# Altium schematic sheet SCH_AP-DIsplay-2.1_Altium.schdoc
size 302 x 211 mm
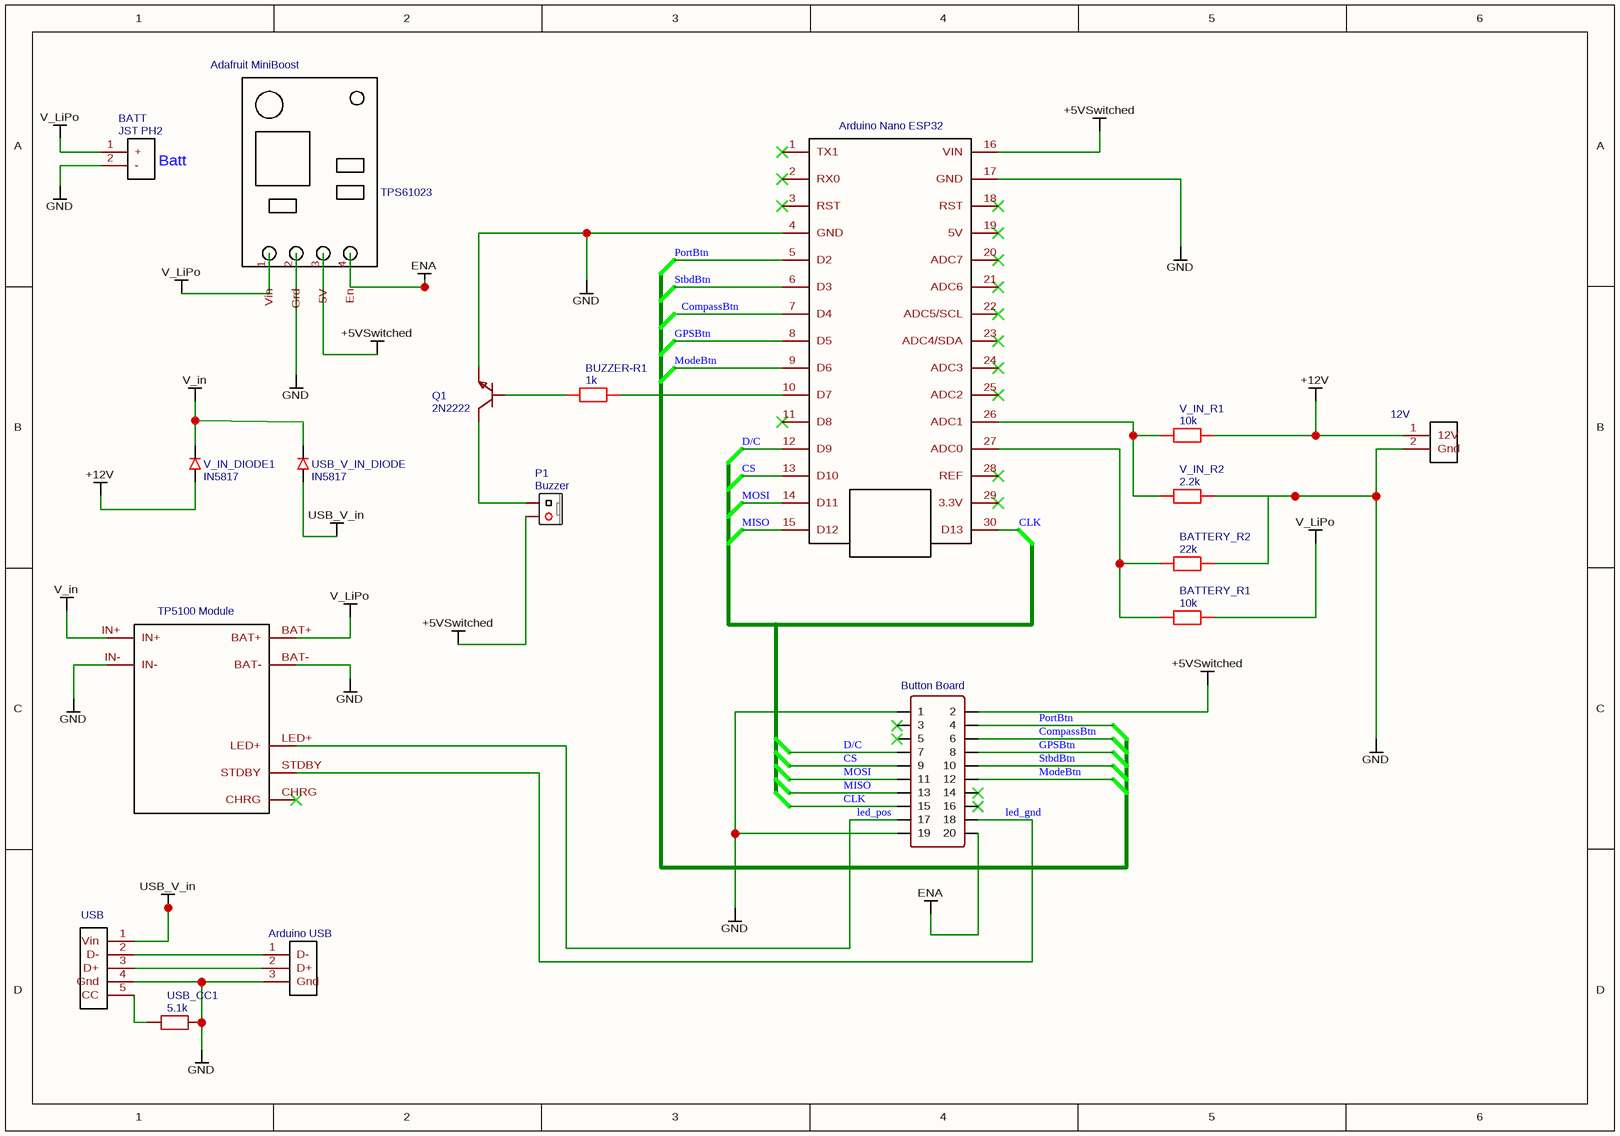
[diagram p0: SCH_AP-DIsplay-2.1_Altium.schdoc]

## Parts
1X2_JST_XH  12V  [1X2 JST XH]
BATT  JST PH2  [JST-PH-JST-PH2]
BATTERY_R1  10k  [R_AXIAL-0.5]
BATTERY_R2  22k  [R_AXIAL-0.5]
BUTTON_LED1  Button Board  [HDR-M-2.54_2X10]
BUZZER-R1  1k  [R_AXIAL-0.5]
JST_XH_1X3  Arduino USB  [JST XH 1X3]
JST_XH_1X5  USB  [JST XH 1X5]
P1  Buzzer  [HDR-1X2M-P-2.54MM-JST XH NO]
Q1  2N2222  [TO-92-3_L4.9-W3.7-P1.27-L]
TPS61023  Adafruit MiniBoost  [ADAFRUIT MINIBOOST 5V @ 1A - TPS61023 FOOTPRINT]
U1  Arduino Nano ESP32  [ADUINO NANO R3]
U3  TP5100 Module  [TP5100-MODULE]
USB_CC1  5.1k  [R_AXIAL-0.5]
USB_V_IN_DIODE  IN5817  [DIODE NI RAMON]
V_IN_DIODE1  IN5817  [DIODE NI RAMON]
V_IN_R1  10k  [R_AXIAL-0.5]
V_IN_R2  2.2k  [R_AXIAL-0.5]

## Nets
+5VSwitched: BUTTON_LED1.2 P1.2 TPS61023.3(5V) U1.16(VIN)
+12V: 1X2_JST_XH.1(12V) V_IN_DIODE1.1 V_IN_R1.2
ENA: BUTTON_LED1.20 TPS61023.4(En)
GND: 1X2_JST_XH.2(Gnd) BATT.2(-) BATTERY_R2.2 BUTTON_LED1.1 BUTTON_LED1.19 JST_XH_1X3.3(Gnd) JST_XH_1X5.4(Gnd) Q1.1(E) TPS61023.2(Grd) U1.4(GND) U1.17(GND) U3.BAT- U3.IN- USB_CC1.1 V_IN_R2.2
USB_V_in: JST_XH_1X5.1(Vin) USB_V_IN_DIODE.1
V_in: U3.IN+ USB_V_IN_DIODE.2 V_IN_DIODE1.2
V_LiPo: BATT.1(+) BATTERY_R1.2 TPS61023.1(Vin) U3.BAT+
CLK: BUTTON_LED1.15 U1.30(D13)
CompassBtn: BUTTON_LED1.6 U1.7(D4)
CS: BUTTON_LED1.9 U1.13(D10)
D/C: BUTTON_LED1.7 U1.12(D9)
GPSBtn: BUTTON_LED1.8 U1.8(D5)
led_gnd: BUTTON_LED1.18 U3.STDBY
led_pos: BUTTON_LED1.17 U3.LED+
MISO: BUTTON_LED1.13 U1.15(D12)
ModeBtn: BUTTON_LED1.12 U1.9(D6)
MOSI: BUTTON_LED1.11 U1.14(D11)
PortBtn: BUTTON_LED1.4 U1.5(D2)
StbdBtn: BUTTON_LED1.10 U1.6(D3)
NetBATTERY_R1_1: BATTERY_R1.1 BATTERY_R2.1 U1.27(ADC0)
NetBUZZER-R1_1: BUZZER-R1.1 Q1.2(B)
NetBUZZER-R1_2: BUZZER-R1.2 U1.10(D7)
NetJST_XH_1X3_1: JST_XH_1X3.1(D-) JST_XH_1X5.2(D-)
NetJST_XH_1X3_2: JST_XH_1X3.2(D+) JST_XH_1X5.3(D+)
NetJST_XH_1X5_5: JST_XH_1X5.5(CC) USB_CC1.2
NetP1_1: P1.1 Q1.3(C)
NetU1_26: U1.26(ADC1) V_IN_R1.1 V_IN_R2.1

Not connected (* = marked no-connect by the designer): BUTTON_LED1 3* 5* 14* 16*; U1 1(TX1)* 2(RX0)* 3(RST)* 11(D8)* 18(RST)* 19(5V)* 20(ADC7)* 21(ADC6)* 22(ADC5/SCL)* 23(ADC4/SDA)* 24(ADC3)* 25(ADC2)* 28(REF)* 29(3.3V)*; U3 CHRG*

## Notes on the sheet
- (in symbol JST PH2) Batt

## Library data of the parts
1X2_JST_XH = 12V: Contributor: edelarosar1700; spicePre: U; spiceSymbolName: 1x2 JST XH
BATT = JST PH2: Contributor: pwarrow99; spicePre: U; spiceSymbolName: JST PH2
BATTERY_R1 V_IN_R1 = 10k: Contributor: Kagutsuchi; spicePre: R; spiceSymbolName: 1w resistor
BATTERY_R2 = 22k: Contributor: Kagutsuchi; spicePre: R; spiceSymbolName: 1w resistor
BUTTON_LED1 = Button Board: Contributor: LCEDA_Lib; Supplier Part: C124359; Supplier: LCSC; spicePre: J; spiceSymbolName: HDR-M-2.54_2x10
BUZZER-R1 = 1k: Contributor: Kagutsuchi; spicePre: R; spiceSymbolName: 1w resistor
JST_XH_1X3 = Arduino USB: Contributor: GeMeMe; spicePre: U; spiceSymbolName: JST XH 1x3
JST_XH_1X5 = USB: Contributor: GeMeMe; spicePre: U; spiceSymbolName: JST XH 1x5
P1 = Buzzer: Manufacturer Part: Headers  Pins2.54mm1*10P; Contributor: jousterde1; Supplier: LCSC; image: http://image.lceda.cn/szlcsc/C57369.jpg; Supplier Part: C57369; spicePre: P; spiceSymbolName: HDR-2.54_1x2_N_O
Q1 = 2N2222: Manufacturer: ST(先科); Manufacturer Part: 2N2222A; Contributor: LCSC; Supplier: LCSC; Supplier Part: C118536; JLCPCB Part Class: Extended Part; spicePre: Q; spiceSymbolName: 2N2222
TPS61023 = Adafruit MiniBoost: Contributor: jefflorditch; spicePre: U; spiceSymbolName: Adafruit MiniBoost 5V @ 1A - TPS61023
U1 = Arduino Nano ESP32: Contributor: Nikolay Yanev; spicePre: U; spiceSymbolName: ARDUINO_NANO_R3
U3 = TP5100 Module: Contributor: cropemail; Manufacturer Part: TP5100-MODULE; spicePre: U; spiceSymbolName: TP5100-MODULE
USB_CC1 = 5.1k: nameAlias: Value(Ω); Contributor: LCEDA_Lib; spicePre: R; spiceSymbolName: R_0402_EU
USB_V_IN_DIODE V_IN_DIODE1 = IN5817: Manufacturer Part: DIODE; Contributor: mimit.oscar; spicePre: D; spiceSymbolName: in5004 diode
V_IN_R2 = 2.2k: Contributor: Kagutsuchi; spicePre: R; spiceSymbolName: 1w resistor